# EAGLE design untitled (EAGLE 5.06)
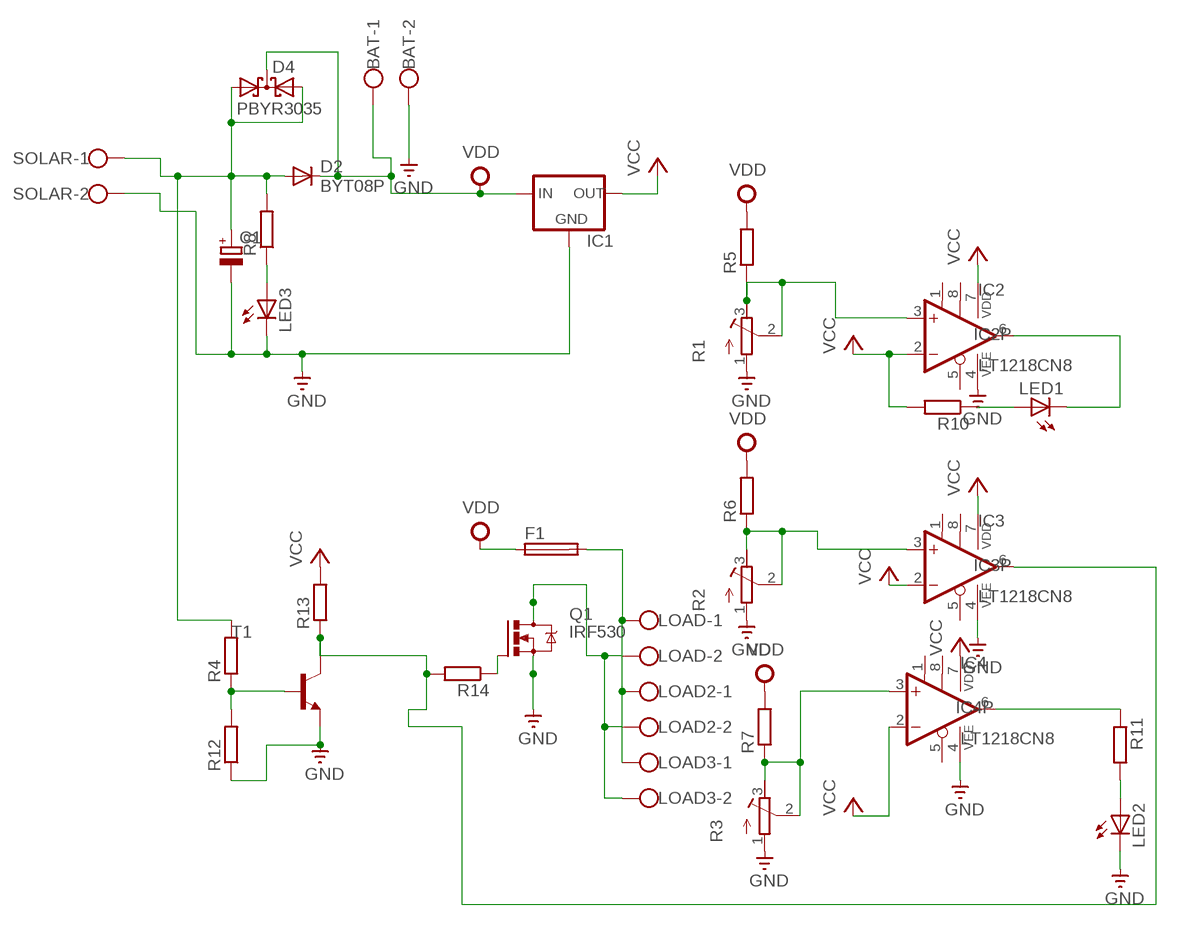
[diagram p0: schematic, sheet 1]

## Parts
BAT  AK300/2  [AK300/2]
C1  CPOL-EUE5-8.5  [E5-8,5]
D2  BYT08P  [TO220ACS]
D4  PBYR3035  [SOT93S]
F1  SH22,5A  [SH22,5A]
IC1  78XXS  [78XXS]
IC2  LT1218CN8  [DIL08]
IC3  LT1218CN8  [DIL08]
IC4  LT1218CN8  [DIL08]
LED1  LEDSFH482  [SFH482]
LED2  LEDSFH482  [SFH482]
LED3  LEDSFH482  [SFH482]
LOAD  AK300/2  [AK300/2]
LOAD2  AK300/2  [AK300/2]
LOAD3  AK300/2  [AK300/2]
Q1  IRF530  [TO220BV]
R1  R-TRIMM64W  [RTRIM64W]
R2  R-TRIMM64W  [RTRIM64W]
R3  R-TRIMM64W  [RTRIM64W]
R4  R-EU_0207/10  [0207/10]
R5  R-EU_0207/10  [0207/10]
R6  R-EU_0207/10  [0207/10]
R7  R-EU_0207/10  [0207/10]
R8  R-EU_0207/10  [0207/10]
R10  R-EU_0207/10  [0207/10]
R11  R-EU_0207/10  [0207/10]
R12  R-EU_0207/10  [0207/10]
R13  R-EU_0207/10  [0207/10]
R14  R-EU_0207/10  [0207/10]
SOLAR  AK300/2  [AK300/2]
T1  2N5400-NPN-TO92-CBE  [TO92-CBE]

## Nets
GND: BAT.2 C1.- IC1.GND IC2.4(VEE) IC3.4(VEE) IC4.4(VEE) LED2.K(C) LED3.K(C) Q1.S R1.1(E) R2.1(E) R3.1(E) R12.1 SOLAR.2 T1.E
N$1: C1.+ D2.A D4.A1 D4.A2 R4.2 R8.2 SOLAR.1
N$2: LOAD2.2 LOAD3.2 LOAD.2 Q1.D
N$3: F1.2 LOAD2.1 LOAD3.1 LOAD.1
N$4: IC3.3(+IN) R2.2(S) R2.3(A) R6.1
N$5: IC2.3(+IN) R1.2(S) R1.3(A) R5.1
N$6: IC4.3(+IN) R3.2(S) R3.3(A) R7.1
N$8: R4.1 R12.2 T1.B
N$9: IC3.6(OUT) R13.1 R14.2 T1.C
N$10: Q1.G R14.1
N$12: IC2.6(OUT) LED1.K(C)
N$14: IC4.6(OUT) R11.1
N$15: LED1.A R10.1
N$42: LED3.A R8.1
N$43: LED2.A R11.2
VCC: IC1.OUT IC2.2(-IN) IC2.7(VDD) IC3.2(-IN) IC3.7(VDD) IC4.2(-IN) IC4.7(VDD) R10.2 R13.2
VDD: BAT.1 D2.C D4.C F1.1 IC1.IN R5.2 R6.2 R7.2
Unconnected: IC2.1(TRIM1) IC2.5(/SHDN) IC2.8(TRIM2) IC3.1(TRIM1) IC3.5(/SHDN) IC3.8(TRIM2) IC4.1(TRIM1) IC4.5(/SHDN) IC4.8(TRIM2)

## Library data of the parts
BAT LOAD LOAD2 LOAD3 SOLAR = con-ptr500+:AK300/2: CONNECTOR
C1 = resistor:CPOL-EU: POLARIZED CAPACITOR, European symbol
D2 = diode:BYT08P: DIODE ultra fast
D4 = diode-1:PBYR3035: Dual DIODE common cathode
F1 = fuse:SH22,5A: FUSE HOLDER grid 22,5mm, isolated cap OGN0031 8201, Schurter (Buerklin)
IC1 = v-reg:78XXS: VOLTAGE REGULATOR
IC2-IC4 = linear-technology-3:LT1218*: Precision Rail-to-Rail Input and Output OpAmp with Shutdown
LED1-LED3 = adafruit:LED: LED OSRAM: - CHIPLED LG R971, LG N971, LY N971, LG Q971, LY Q971, LO R971, LY R971 LH N974, LH R974 LS Q976, LO Q976, LY Q976 LO Q996 - Hyper CHIPLED LW Q18S LB Q993, LB Q99A, LB R99A - SideLED LS A670, LO A670, LY A670, LG A670, LP A670 LB A673, LV A673, LT A673, LW A673 LH A674 LY A675 LS A676, LA A676, LO A676, LY A676, LW A676 LS A679, LY A679, LG A679 - Hyper Micro SIDELED® LS Y876, LA Y876, LO Y876, LY Y876 LT Y87S - SmartLED LW L88C, LW L88S LB L89C, LB L89S, LG L890 LS L89K, LO L89K, LY L89K LS L896, LA L896, LO L896, LY L896 - TOPLED LS T670, LO T670, LY T670, LG T670, LP T670 LSG T670, LSP T670, LSY T670, LOP T670, LYG T670 LG T671, LOG T671, LSG T671 LB T673, LV T673, LT T673, LW T673 LH T674 LS T676, LA T676, LO T676, LY T676, LB T676, LH T676, LSB T676, LW T676 LB T67C, LV T67C, LT T67C, LS T67K, LO T67K, LY T67K, LW E67C LS E67B, LA E67B, LO E67B, LY E67B, LB E67C, LV E67C, LT E67C LW T67C LS T679, LY T679, LG T679 LS T770, LO T770, LY T770, LG T770, LP T770 LB T773, LV T773, LT T773, LW T773 LH T774 LS E675, LA E675, LY E675, LS T675 LS T776, LA T776, LO T776, LY T776, LB T776 LHGB T686 LT T68C, LB T68C - Hyper Mini TOPLED® LB M676 - Mini TOPLED Santana® LG M470 LS M47K, LO M47K, LY M47K Source: http://www.osram.convergy.de/
Q1 = transistor-power:IRF530: HEXFET Power MOSFET
R1-R3 = resistor:R-TRIMM: Trimm resistor
R4-R8 R10-R14 = resistor:R-EU_: RESISTOR, European symbol
T1 = transistor:*-NPN-: NPN Transistror BF959 corrected 2008.03.06

## Board
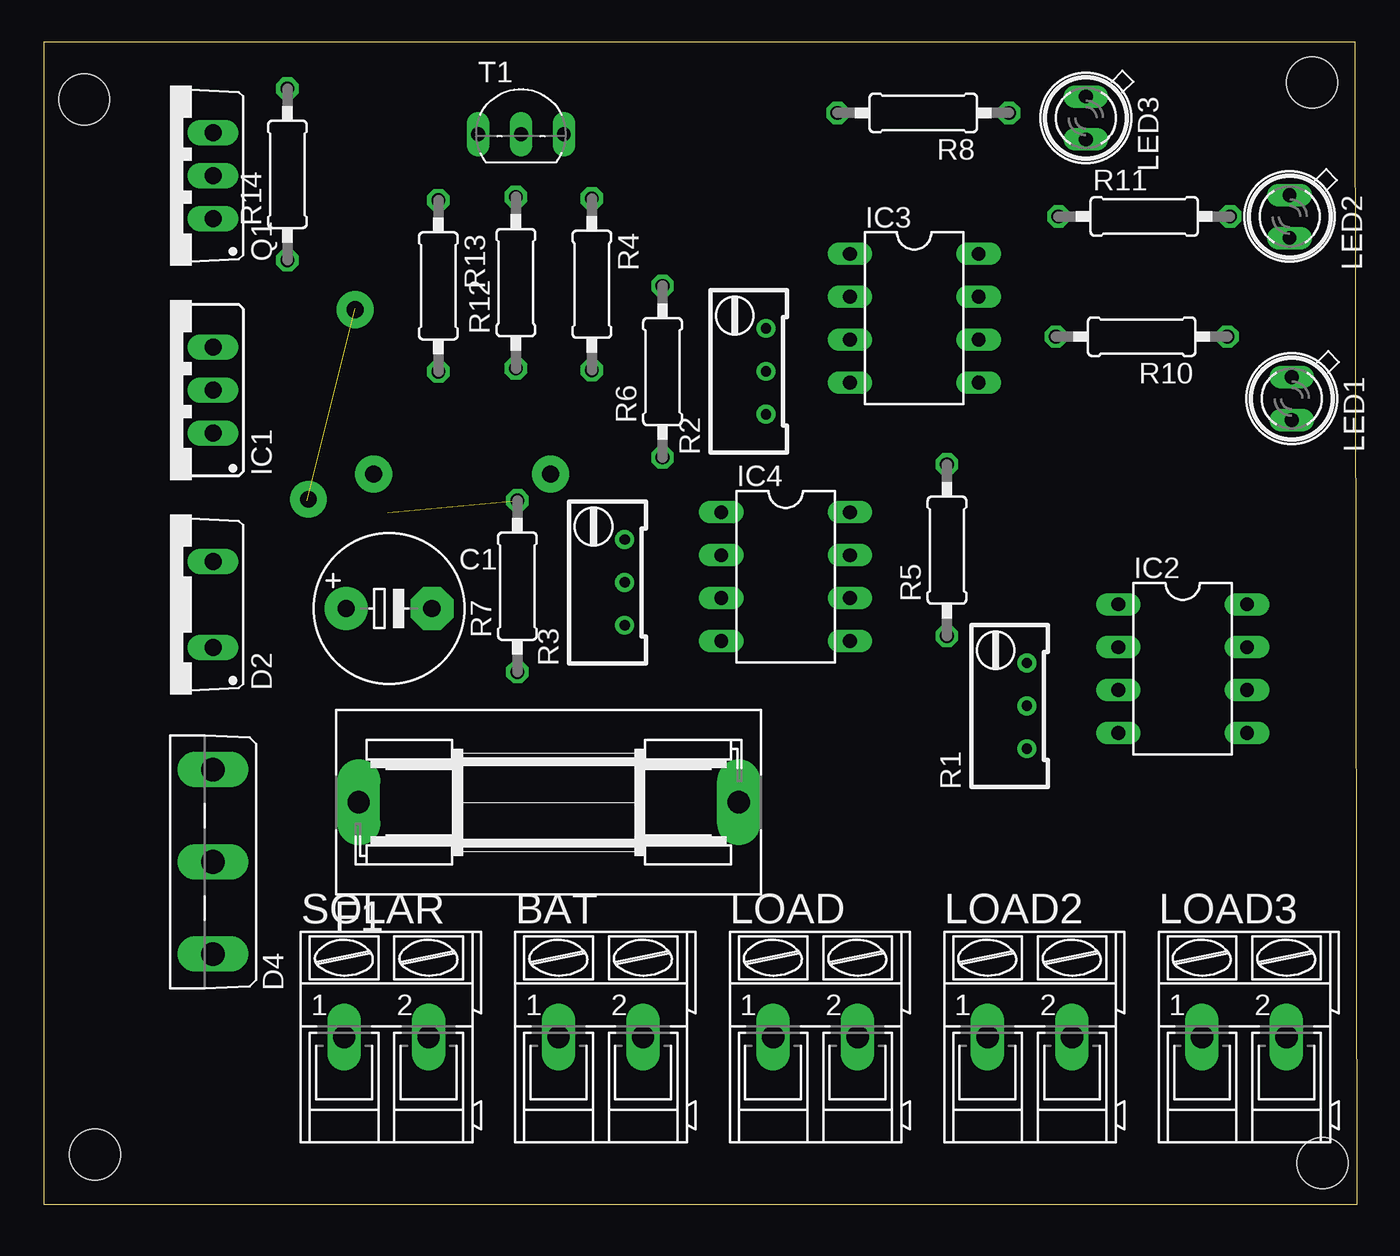
[diagram p1: board, top side]
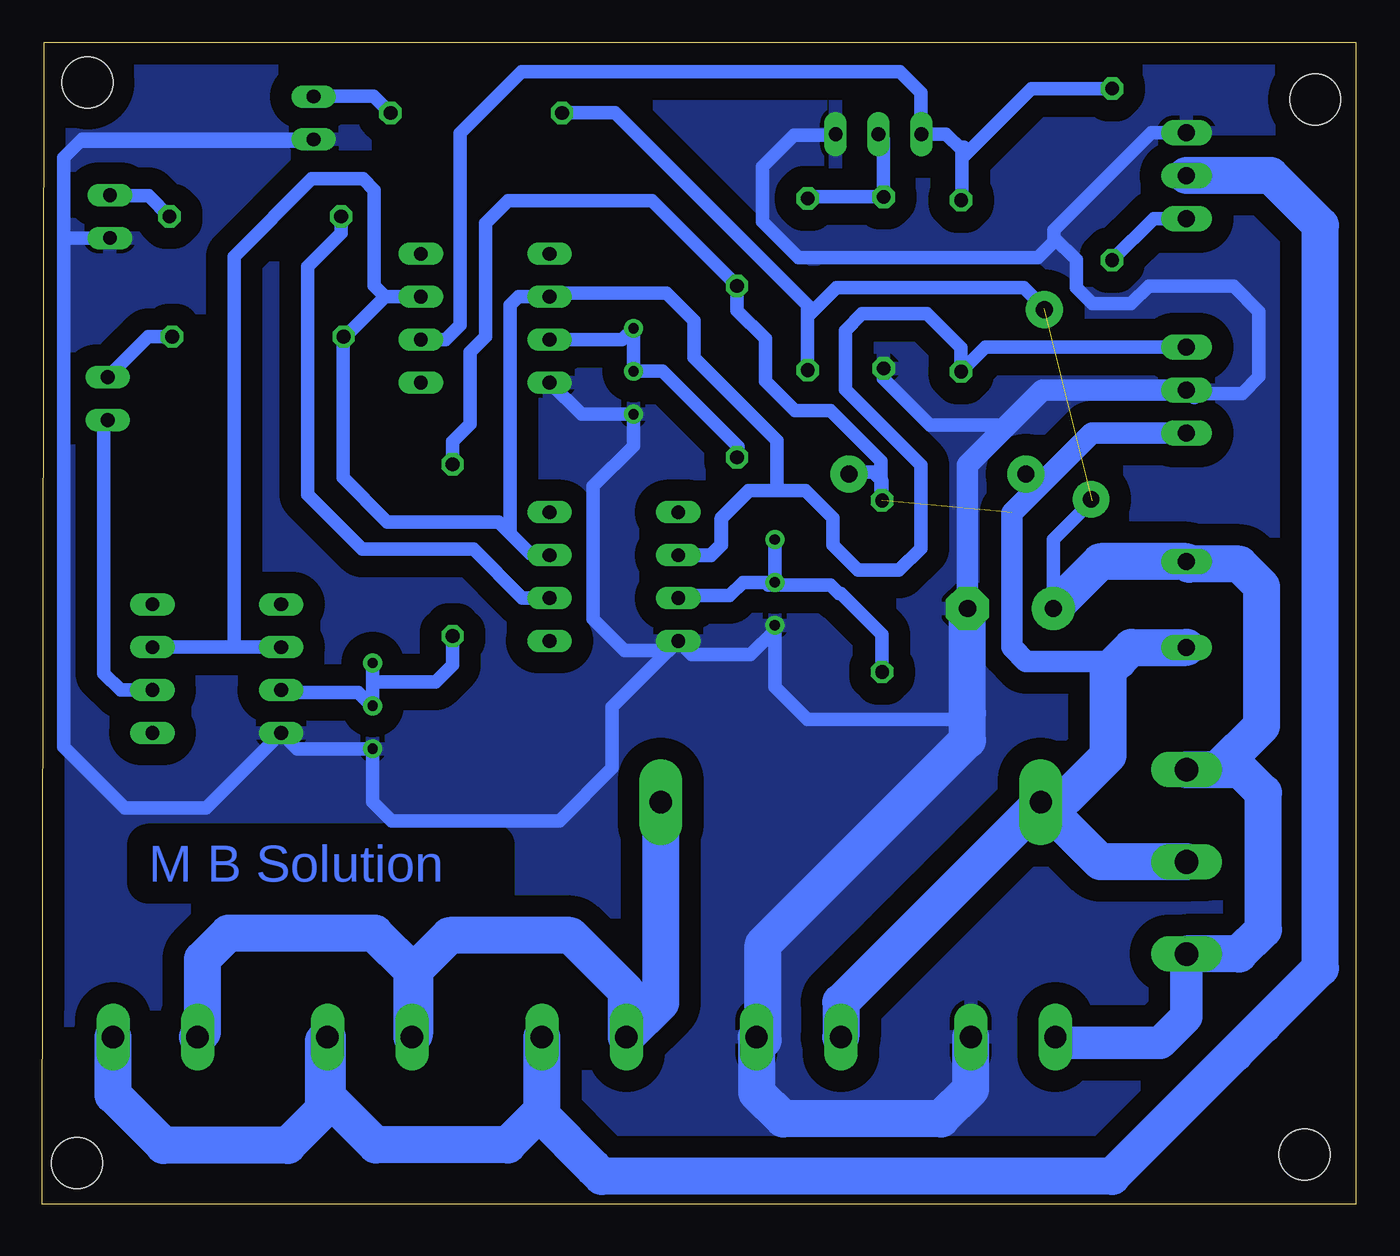
[diagram p2: board, bottom side, seen from below]

Size 77.79 x 68.83 mm. Coordinates in mm from the lower left corner, seen from the top.
Outline: 0,0 77.79,0.02 77.68,68.83 0.01,68.83 0,0
Copper layers (1*16): Top 0.035mm / dielectric 1.5mm / Bottom 0.035mm
Design rules "default": minimum track width 10mil, minimum drill 24mil, track to track 8mil, track to pad 8mil, pad to pad 8mil, via to via 8mil, smd to smd 8mil, copper to edge 40mil, drill to drill 8mil, minimum pad ring 10mil, minimum via ring 8mil, stop-mask expansion 4mil, vias tented up to drill 0mil, thermal gap 10mil
Holes 3 mm at 3.04,2.95 2.41,65.45 75.11,66.46 75.74,2.45

### Footprints (pad centres in the part's own frame; a part is rotated, then mirrored left to right if it is on the bottom)
AK300/2 = drill 1.321 long: 1 -2.515,0; 2 2.489,0
E5-8,5 = drill 1.016 pad 2.54 round: + -2.54,0 | drill 1.016 pad 2.54 octagon: - 2.54,0
TO220ACS = drill 1.016 long: A 2.54,-2.54; C -2.54,-2.54
SOT93S = drill 1.397 long: A1 -5.461,-2.54; A2 5.461,-2.54; C 0,-2.54
SH22,5A = drill 1.321 pad 2.54 long: 1 -11.252,0; 2 11.252,0
78XXS = drill 1.016 long: GND 0,-2.54; IN -2.54,-2.54; OUT 2.54,-2.54
DIL08 = drill 0.813 long: 1 -3.81,-3.81; 2 -1.27,-3.81; 3 1.27,-3.81; 4 3.81,-3.81; 5 3.81,3.81; 6 1.27,3.81; 7 -1.27,3.81; 8 -3.81,3.81
SFH482 = drill 0.813 long: A -1.27,0; K 1.27,0
TO220BV = drill 1.016 long: D 0,-2.54; G -2.54,-2.54; S 2.54,-2.54
RTRIM64W = drill 0.61 round: 1 1.27,-2.54; 2 1.27,0; 3 1.27,2.54
0207/10 = drill 0.813 octagon: 1 -5.08,0; 2 5.08,0
TO92-CBE = drill 0.813 long: B 0,0; C -2.54,0; E 2.54,0

### Placement (x,y rotation side)
BAT  33.01,9.92 0 top
C1  20.45,35.3 0 top
D2  7.49,35.53 90 top
D4  7.49,20.29 90 top
F1  29.91,23.82 0 top
IC1  7.49,48.23 90 top
IC2  67.46,31.74 270 top
IC3  51.55,52.49 270 top
IC4  43.94,37.19 270 top
LED1  73.91,47.73 270 top
LED2  73.79,58.51 270 top
LED3  61.72,64.35 270 top
LOAD  45.71,9.92 0 top
LOAD2  58.41,9.92 0 top
LOAD3  71.11,9.92 0 top
Q1  7.49,60.93 90 top
R1  56.96,29.53 0 top
R2  41.51,49.34 0 top
R3  33.14,36.84 0 top
R4  32.47,54.5 270 top
R5  53.49,38.75 90 top
R6  36.65,49.33 90 top
R7  28.06,36.62 90 top
R8  52.09,64.65 180 top
R10  65.02,51.39 180 top
R11  65.17,58.51 0 top
R12  27.96,54.6 90 top
R13  23.38,54.4 270 top
R14  14.44,61.01 90 top
SOLAR  20.31,9.92 0 top
T1  28.27,63.39 0 top

### Tracks (layer width: path | path; a pad name or v marks a point on that pad's centre or on a via)
GND
  Bottom 0.813: Q1.S 12.12,63.47 17.88,57.71 17.88,57.27 | R12.1 27.96,48.9 25.22,46.16 21.04,46.16 20.84,45.96 | 17.88,57.27 17.88,57.03 18.83,56.09 33.02,56.09 35.14,58.21 35.14,61.46 33.27,63.32 30.87,63.32 T1.E | 22.99,29.08 23.37,28.71 32.48,28.71 34.41,30.64 R3.1 34.41,34 35.84,32.57 39.33,32.57 IC4.4 | IC4.4 44.05,29.46 44.05,25.84 47.16,22.73 57.11,22.73 58.23,23.85 R1.1 62.71,26.99 IC2.4 68.1,23.48 72.9,23.48 76.51,27.08 76.51,57.36 | 76.51,58.18 76.51,62 75.54,62.97 61.83,62.97 LED3.K 75.41,63.08 76.51,61.98 76.51,57.36 | IC3.4 45.87,46.8 R2.1 42.78,44.93 45.17,42.54 45.17,34.69 43.3,32.82 40.68,32.82 IC4.4 | IC1.GND 9.58,47.78 9.33,48.03 6.73,48.03 5.74,49.02 5.74,52.89 7.23,54.38 12.27,54.38 13.31,53.34 15.61,53.34 16.56,54.29 16.56,55.94 17.88,57.27 | LED2.K 76.39,57.24 76.51,57.36
  Bottom 1.27: IC1.GND 18.56,48.23 20.84,45.96 22.99,43.8 C1.-
  Bottom 2.184: SOLAR.2 22.8,6.83 24.56,5.07 33.9,5.07 35.47,6.63 35.47,9.39 | 35.47,9.39 35.47,9.88 BAT.2 | C1.- 22.99,29.08 22.99,27.51 35.11,15.39 35.11,9.75 35.47,9.39
  pour Bottom (isolate 1.27): 0.39,67.36 0.39,0.05 76.59,0.05 76.59,67.36
N$1  (1 unrouted)
  Bottom 0.813: R8.2 43.86,64.65 32.48,53.26 32.48,49.43 R4.2 32.47,52.59 30.77,54.29 19.67,54.29 18.45,53.07 | C1.+ 17.91,39.39 15.61,41.69
  Bottom 1.93: D4.A1 10.03,11.11 11.57,9.57 17.45,9.57 SOLAR.1
  Bottom 2.184: D4.A1 6.92,14.83 5.48,16.27 5.48,24.38 6.85,25.75 D4.A2 8.17,25.75 5.57,28.34 5.57,36.6 6.89,37.92 9.88,37.92 D2.A 15.14,38.07 C1.+
N$2
  Bottom 2.184: LOAD3.2 73.6,6.49 70.6,3.5 63.24,3.5 61.14,5.6 61.14,9.68 LOAD2.2 60.9,6.39 58.04,3.52 50.23,3.52 48.22,5.54 48.22,9.9 LOAD.2 48.2,5.21 45.17,2.18 45.17,2.17 44.66,1.66 14.45,1.66 7.17,8.94 | 7.17,8.94 5.48,10.63 | Q1.D 5.04,60.93 2.1,57.98 2.1,14.01 7.17,8.94
N$3
  Bottom 2.184: F1.2 41.16,11.96 LOAD.1 43.2,12.61 46.51,15.93 53.67,15.93 55.74,13.85 55.74,10.07 LOAD2.1 55.9,13.87 58.09,16.07 66.77,16.07 68.31,14.53 68.31,10.21 LOAD3.1
N$4
  Bottom 0.813: IC3.3 43.44,51.22 R2.3 R2.2 41.07,49.34 36.6,44.87 36.6,44.3 R6.1
N$5
  Bottom 0.813: 58.23,31.08 R1.2 58.3,29.53 59.1,30.33 63.51,30.33 IC2.3 | 58.23,31.08 R1.3 | R5.1 53.49,31.95 54.49,30.95 58.1,30.95 58.23,31.08
N$6
  Bottom 0.813: R3.3 R3.2 34.97,36.84 | 34.97,36.84 36.3,36.84 37.08,36.06 40.44,36.06 40.56,36.19 40.4,36.19 IC4.3 | R7.1 28.06,33.76 30.49,36.19 30.61,36.19 31.11,36.69 34.81,36.69 34.97,36.84
N$8
  Bottom 0.813: T1.B 27.96,63.09 R12.2 32.37,59.68 R4.1
N$9
  Bottom 0.813: 23.34,62.46 24.26,63.39 T1.C 25.76,63.43 25.76,65.85 27.01,67.09 49.39,67.09 50.26,66.22 51.01,65.47 | 23.34,61.95 23.34,59.52 R13.1 | 23.34,61.95 23.34,62.46 | 23.34,62.46 23.2,62.6 | 51.01,65.47 51.38,65.1 | IC3.6 53.9,51.22 53.05,52.07 53.05,63.44 51.01,65.47 | R14.2 19.2,66.09 23.34,61.95
N$10
  Bottom 0.813: Q1.G 11.98,58.39 R14.1
N$12
  Bottom 0.813: IC2.6 73.16,30.47 74.14,31.45 74.14,46.23 LED1.K
N$13  (via drill 1 pad 2.18)
  other vias: 18.44,52.99
N$14
  Bottom 0.813: IC4.6 49.36,35.92 52.25,38.81 58.84,38.81 62.08,42.05 62.08,55.55 60.09,57.54 R11.1
N$15
  Bottom 0.813: R10.1 71.52,51.39 LED1.A
N$17  (via drill 1 pad 2.18)
  other vias: 15.68,41.76
N$18  (via drill 1 pad 2.18)
  other vias: 19.54,43.25
N$19  (via drill 1 pad 2.18)
  other vias: 30.02,43.25
N$42
  Bottom 0.813: R8.1 57.2,64.65 58.18,65.63 LED3.A
N$43
  Bottom 0.813: 73.7,59.87 LED2.A 73.75,59.74 71.5,59.74 70.27,58.51 R11.2
VCC
  Bottom 0.813: IC2.7 IC2.2 66.24,33.01 66.43,33.2 66.43,56.14 61.83,60.74 58.8,60.74 58.14,60.08 58.14,54.43 57.47,53.76 | R10.2 59.84,51.39 57.48,53.76 57.47,53.76 | IC3.7 57.47,53.76 | 48.25,53.76 IC3.2 | IC4.7 47.85,38.56 48.9,38.56 49.65,39.31 | 57.47,53.76 59.97,51.27 59.97,43.04 57.35,40.43 50.77,40.43 49.65,39.31 | 48.25,53.76 48.05,53.96 40.82,53.96 39.2,52.35 39.2,50.15 34.29,45.24 34.29,42.35 34.36,42.27 35.9,42.27 37.59,40.59 37.59,39.08 38.22,38.46 IC4.2 40.11,38.43 38.2,38.43 37.58,39.05 37.58,40.67 35.96,42.29 32.6,42.29 30.97,40.66 30.97,39.05 29.48,37.56 27.04,37.56 25.76,38.84 25.76,43.79 30.24,48.27 30.24,51.77 29.24,52.76 25.39,52.76 23.38,50.75 R13.2 21.93,50.77 IC1.OUT | 48.25,53.76 49.58,53.76 50.08,53.26 50.08,39.74 49.65,39.31
VDD  (1 unrouted)
  Bottom 0.813: R5.2 53.49,45.19 52.46,46.23 52.46,50.47 51.52,51.4 51.52,58.13 50.21,59.44 41.68,59.44 R6.2 36.65,52.95 34.97,51.27 34.97,48.77 33.23,47.03 31.12,47.03 28.13,44.04 28.13,41.76 R7.2 28.06,42.84 28.6,43.39 29.82,43.39 29.95,43.25 | 17.89,43.5 17.82,43.5 20.38,40.94 20.38,40.99 18.66,42.71 19.06,42.71 19.54,43.18
  Bottom 1.27: IC1.IN 15.62,45.69 20.38,40.94 20.38,33.01 19.53,32.16 14.11,32.16
  Bottom 1.422: 14.06,32.21 14.11,32.16
  Bottom 2.184: D4.C 15.13,20.29 F1.1 | D2.C 13.29,32.99 14.06,32.21 14.66,31.62 14.66,26.61 17.16,24.11 18.36,24.11 F1.1 | BAT.1 30.5,11.98 F1.1

### Text on the board
Bottom: M B Solution